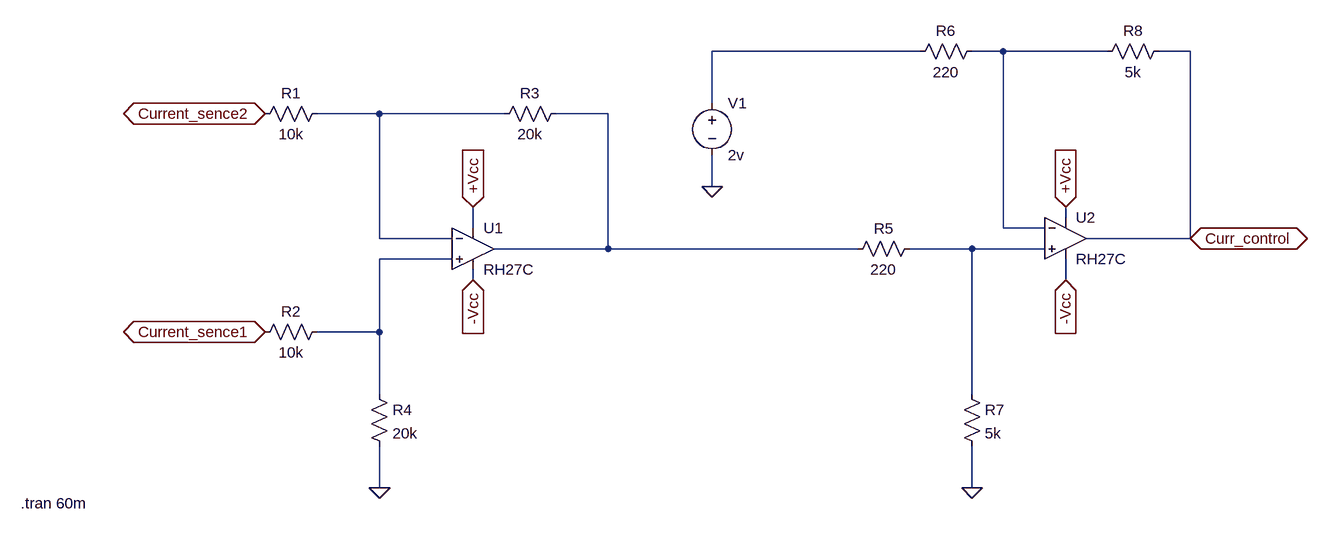
[diagram p0: schematic constant current.asc]
constant current.asc, the LTspice schematic file:
Version 4
SHEET 1 1844 680
WIRE 1008 -288 688 -288
WIRE 1136 -288 1088 -288
WIRE 1296 -288 1136 -288
WIRE 1424 -288 1376 -288
WIRE 688 -208 688 -288
WIRE 176 -192 80 -192
WIRE 368 -192 176 -192
WIRE 528 -192 448 -192
WIRE 688 -80 688 -128
WIRE 1232 -32 1232 -48
WIRE 320 -16 320 -48
WIRE 1136 -16 1136 -288
WIRE 1200 -16 1136 -16
WIRE 176 0 176 -192
WIRE 288 0 176 0
WIRE 1424 0 1424 -288
WIRE 1424 0 1264 0
WIRE 528 16 528 -192
WIRE 528 16 352 16
WIRE 912 16 528 16
WIRE 1088 16 992 16
WIRE 1200 16 1088 16
WIRE 288 32 176 32
WIRE 320 64 320 48
WIRE 1232 64 1232 32
WIRE 176 144 176 32
WIRE 176 144 80 144
WIRE 176 240 176 144
WIRE 1088 240 1088 16
WIRE 176 384 176 320
WIRE 1088 384 1088 320
FLAG 176 384 0
FLAG 1088 384 0
FLAG 688 -80 0
FLAG 1424 0 Curr_control
IOPIN 1424 0 BiDir
FLAG 0 -192 Current_sence2
IOPIN 0 -192 BiDir
FLAG 0 144 Current_sence1
IOPIN 0 144 BiDir
FLAG 320 -48 +Vcc
IOPIN 320 -48 In
FLAG 1232 -48 +Vcc
IOPIN 1232 -48 In
FLAG 320 64 -Vcc
IOPIN 320 64 In
FLAG 1232 64 -Vcc
IOPIN 1232 64 In
SYMBOL res 96 -208 R90
WINDOW 0 0 56 VBottom 2
WINDOW 3 32 56 VTop 2
SYMATTR InstName R1
SYMATTR Value 10k
SYMBOL res 96 128 R90
WINDOW 0 0 56 VBottom 2
WINDOW 3 32 56 VTop 2
SYMATTR InstName R2
SYMATTR Value 10k
SYMBOL OpAmps\\RH27C 320 -48 R0
SYMATTR InstName U1
SYMBOL res 464 -208 R90
WINDOW 0 0 56 VBottom 2
WINDOW 3 32 56 VTop 2
SYMATTR InstName R3
SYMATTR Value 20k
SYMBOL res 160 224 R0
SYMATTR InstName R4
SYMATTR Value 20k
SYMBOL res 1008 0 R90
WINDOW 0 0 56 VBottom 2
WINDOW 3 32 56 VTop 2
SYMATTR InstName R5
SYMATTR Value 220
SYMBOL res 1104 -304 R90
WINDOW 0 0 56 VBottom 2
WINDOW 3 32 56 VTop 2
SYMATTR InstName R6
SYMATTR Value 220
SYMBOL OpAmps\\RH27C 1232 -64 R0
SYMATTR InstName U2
SYMBOL voltage 688 -224 R0
WINDOW 123 0 0 Left 0
WINDOW 39 0 0 Left 0
SYMATTR InstName V1
SYMATTR Value 2v
SYMBOL res 1072 224 R0
SYMATTR InstName R7
SYMATTR Value 5k
SYMBOL res 1392 -304 R90
WINDOW 0 0 56 VBottom 2
WINDOW 3 32 56 VTop 2
SYMATTR InstName R8
SYMATTR Value 5k
TEXT -376 408 Left 2 !.tran 60m

The netlist it stands for:
* constant current.asc
R1 N003 Current_sence2 10k
R2 N006 Current_sence1 10k
XU1 N006 N003 +Vcc -Vcc N004 RH27C  ; pins In+ In- V+ V- OUT
R3 N004 N003 20k
R4 N006 0 20k
R5 N005 N004 220
R6 N002 N001 220
XU2 N005 N002 +Vcc -Vcc Curr_control RH27C  ; pins In+ In- V+ V- OUT
V1 N001 0 2v
R7 N005 0 5k
R8 Curr_control N002 5k
.tran 60m
.backanno
.end